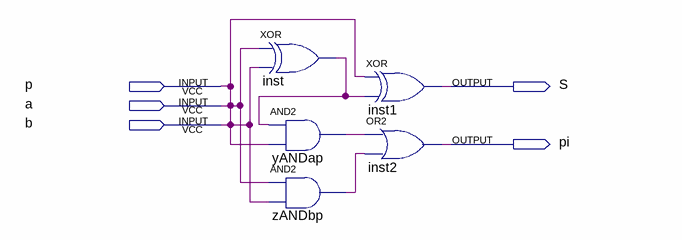
[diagram p0: schematic sheet]
// Quartus schematic sumAND_OR_XOR.bdf as structural Verilog: 5 symbols, 5 pins
module sumAND_OR_XOR (
  input  p,
  input  a,
  input  b,
  output S,
  output pi
);

  wire inst_out, yANDap_out, zANDbp_out;

  xor inst (inst_out, a, a);
  and yANDap (yANDap_out, inst_out, a);
  and zANDbp (zANDbp_out, a, a);
  xor inst1 (S, a, inst_out);
  or inst2 (pi, yANDap_out, zANDbp_out);

  assign b = a;
  assign p = a;
endmodule
